# EAGLE design WindRose_V01_0B (EAGLE 6.6.0)
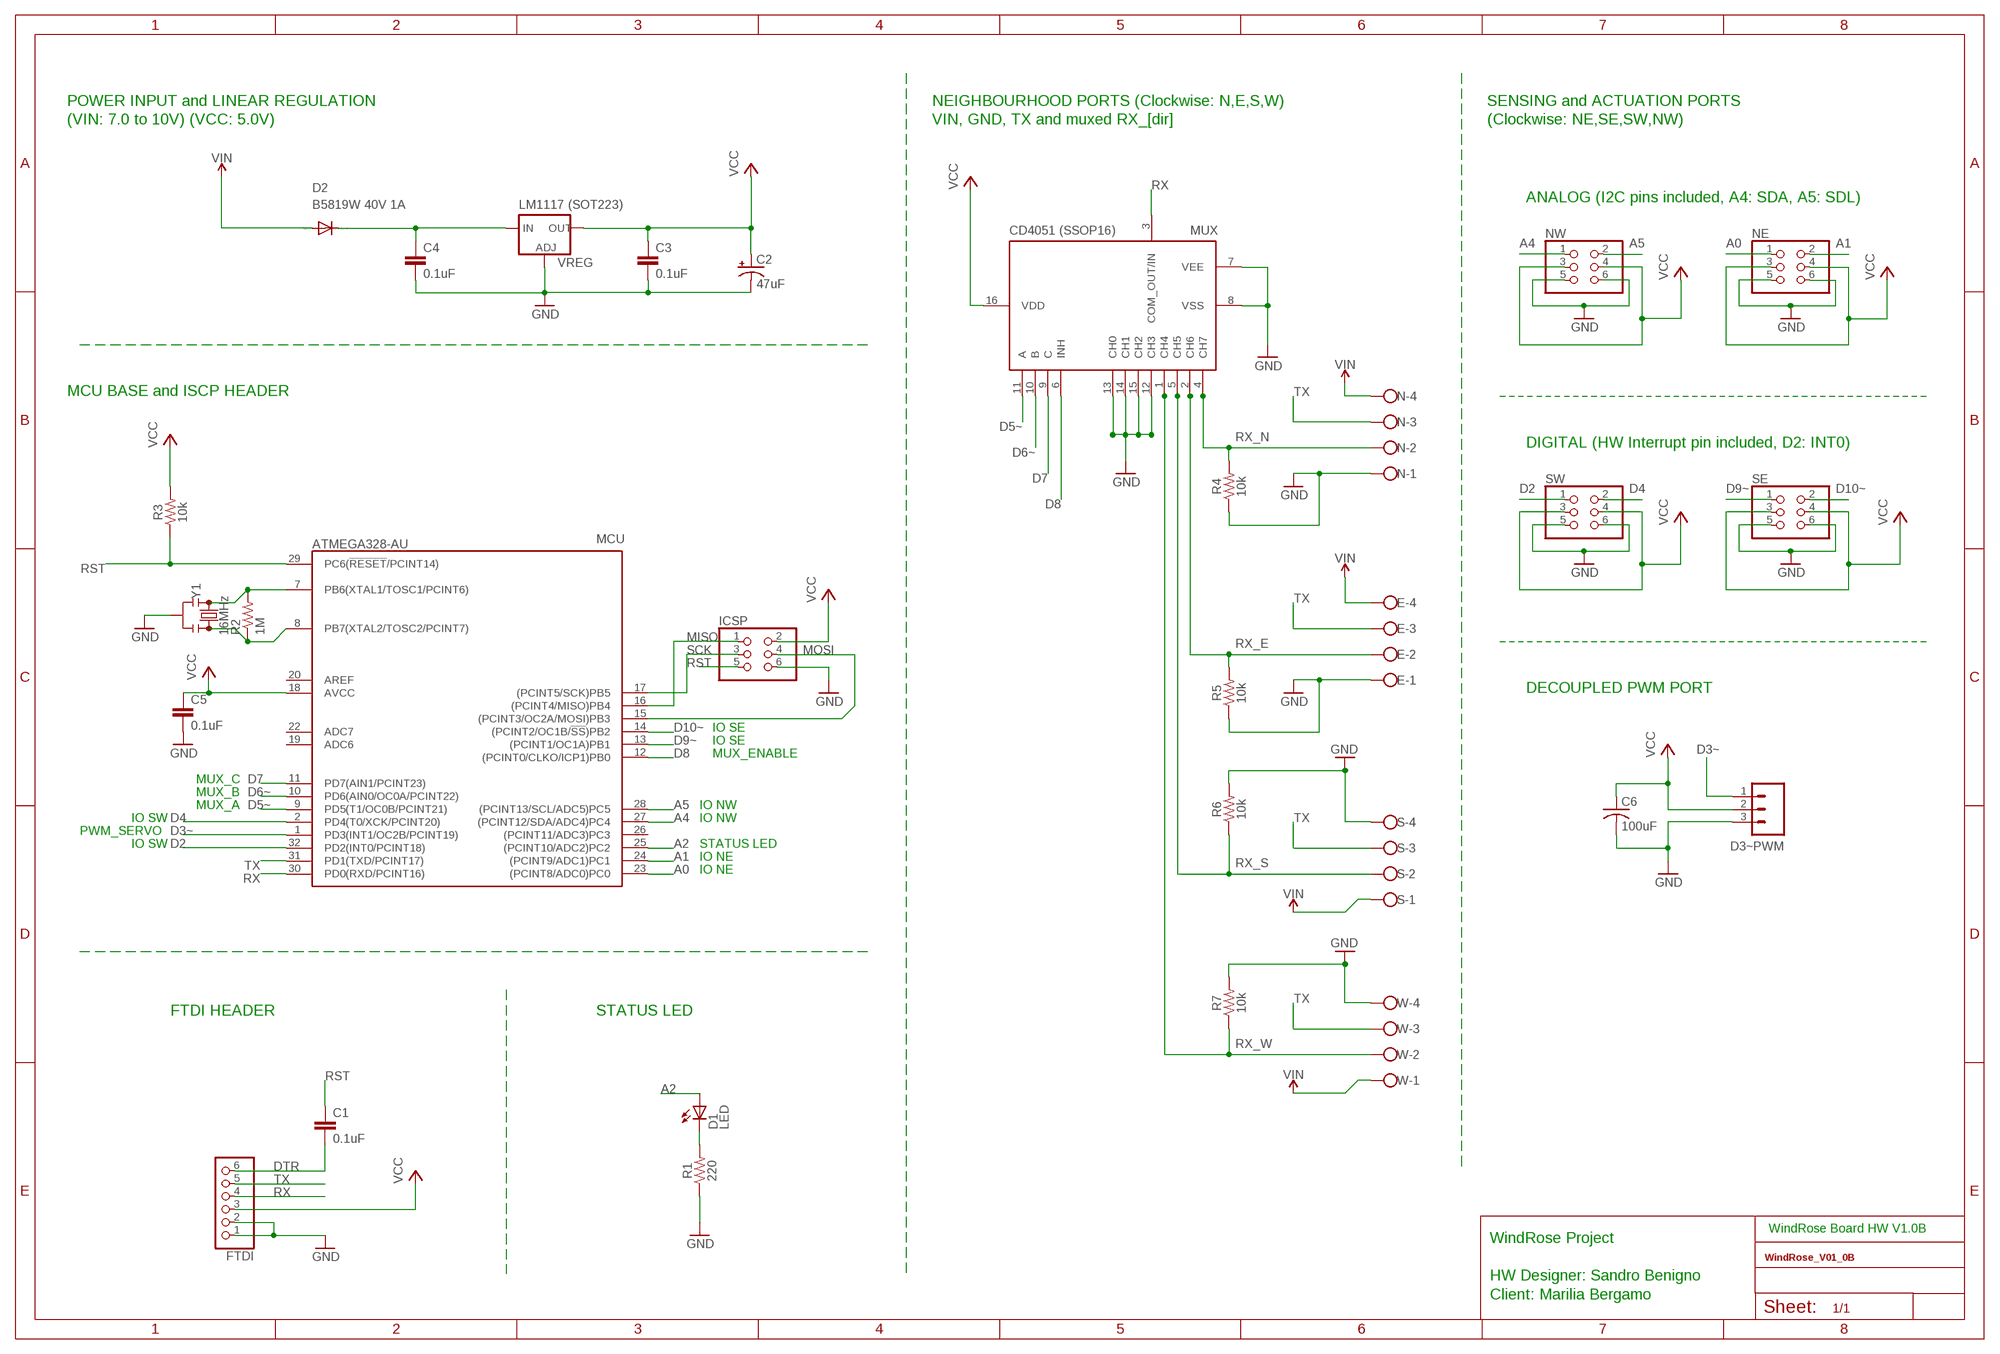
[diagram p0: schematic, sheet 1]

## Parts
C1  0.1uF  0.1UF-0402-6.3V-10%-X7R  [0402]
C2  47uF  10UF-POLAR-EIA3216-16V-10%(TANT)  [EIA3216]
C3  0.1uF  0.1UF-0402-6.3V-10%-X7R  [0402]
C4  0.1uF  0.1UF-0402-6.3V-10%-X7R  [0402]
C5  0.1uF  0.1UF-0402-6.3V-10%-X7R  [0402]
C6  100uF  C-USC3216  [C3216]
D1  LED  LEDCHIP-LED0805  [CHIP-LED0805]
D2  B5819W 40V 1A  DIODE-SOD123  [SOD123]
D3~PWM  455-1750-1-ND  CONN_03  [1X03]
E  W237-4  [W237-4]
FTDI  PINHD-1X6B  [1X06-BIG]
ICSP  PINHD-2X3  [2X03]
MCU  ATMEGA328-AU  [QFP32_7X7_0.80]
MUX  CD4051SSOP16  [SSOP16]
N  W237-4  [W237-4]
NE  PINHD-2X3  [2X03]
NW  PINHD-2X3  [2X03]
R1  220  220OHM-0603-1/10W-1%  [0603]
R2  1M  R-US_R0402  [R0402]
R3  10k  10KOHM-0402-1/16W-1%  [0402]
R4  10k  10KOHM-0402-1/16W-1%  [0402]
R5  10k  10KOHM-0402-1/16W-1%  [0402]
R6  10k  10KOHM-0402-1/16W-1%  [0402]
R7  10k  10KOHM-0402-1/16W-1%  [0402]
S  W237-4  [W237-4]
SE  PINHD-2X3  [2X03]
SW  PINHD-2X3  [2X03]
VREG  V_REG_LM1117SOT223  [SOT223]
W  W237-4  [W237-4]
Y1  16MHz  RESONATOR-16MHZSMD_3.2X1.3  [RESONATOR-SMD-3.2X1.3]

## Nets
A0: MCU.23((PCINT8/ADC0)PC0) NE.1
A1: MCU.24((PCINT9/ADC1)PC1) NE.2
A2: D1.A MCU.25((PCINT10/ADC2)PC2)
A4: MCU.27((PCINT12/SDA/ADC4)PC4) NW.1
A5: MCU.28((PCINT13/SCL/ADC5)PC5) NW.2
D2: MCU.32(PD2(INT0/PCINT18)) SW.1
D3~: D3~PWM.1 MCU.1(PD3(INT1/OC2B/PCINT19))
D4: MCU.2(PD4(T0/XCK/PCINT20)) SW.2
D5~: MCU.9(PD5(T1/OC0B/PCINT21)) MUX.11(A)
D6~: MCU.10(PD6(AIN0/OC0A/PCINT22)) MUX.10(B)
D7: MCU.11(PD7(AIN1/PCINT23)) MUX.9(C)
D8: MCU.12((PCINT0/CLKO/ICP1)PB0) MUX.6(INH)
D9~: MCU.13((PCINT1/OC1A)PB1) SE.1
D10~: MCU.14((PCINT2/OC1B/!SS!)PB2) SE.2
DTR: C1.2 FTDI.6
GND: C2.- C3.2 C4.2 C5.2 C6.2 D3~PWM.3 E.1 FTDI.1 FTDI.2 ICSP.6 MUX.7(VEE) MUX.8(VSS) MUX.12(CH3) MUX.13(CH0) MUX.14(CH1) MUX.15(CH2) N.1 NE.5 NE.6 NW.5 NW.6 R1.1 R4.1 R5.1 R6.2 R7.2 S.4 SE.5 SE.6 SW.5 SW.6 VREG.1(ADJ) W.4 Y1.2
MISO: ICSP.1 MCU.16((PCINT4/MISO)PB4)
MOSI: ICSP.4 MCU.15((PCINT3/OC2A/MOSI)PB3)
N$1: MCU.8(PB7(XTAL2/TOSC2/PCINT7)) R2.1 Y1.3
N$2: MCU.7(PB6(XTAL1/TOSC1/PCINT6)) R2.2 Y1.1
N$3: D1.C R1.2
N$6: C4.1 D2.C VREG.3(IN)
RST: C1.1 ICSP.5 MCU.29(PC6(!RESET!/PCINT14)) R3.1
RX: FTDI.4 MCU.30(PD0(RXD/PCINT16)) MUX.3(COM_OUT/IN)
RX_E: E.2 MUX.2(CH6) R5.2
RX_N: MUX.4(CH7) N.2 R4.2
RX_S: MUX.5(CH5) R6.1 S.2
RX_W: MUX.1(CH4) R7.1 W.2
SCK: ICSP.3 MCU.17((PCINT5/SCK)PB5)
TX: E.3 FTDI.5 MCU.31(PD1(TXD/PCINT17)) N.3 S.3 W.3
VCC: C2.+ C3.1 C5.1 C6.1 D3~PWM.2 FTDI.3 ICSP.2 MCU.18(AVCC) MUX.16(VDD) NE.3 NE.4 NW.3 NW.4 R3.2 SE.3 SE.4 SW.3 SW.4 VREG.2(OUT) VREG.4(OUT)
VIN: D2.A E.4 N.4 S.1 W.1
Unconnected: MCU.19(ADC6) MCU.20(AREF) MCU.22(ADC7) MCU.26((PCINT11/ADC3)PC3)

## Notes on the sheet
- POWER INPUT and LINEAR REGULATION
  (VIN: 7.0 to 10V) (VCC: 5.0V)
- NEIGHBOURHOOD PORTS (Clockwise: N,E,S,W)
  VIN, GND, TX and muxed RX_[dir]
- SENSING and ACTUATION PORTS
  (Clockwise: NE,SE,SW,NW)
- ANALOG (I2C pins included, A4: SDA, A5: SDL)
- LM1117 (SOT223)
- CD4051 (SSOP16) | MUX
- MCU BASE and ISCP HEADER
- DIGITAL (HW Interrupt pin included, D2: INT0)
- DECOUPLED PWM PORT
- IO SE
- IO SE
- MUX_ENABLE
- MUX_C
- MUX_B
- MUX_A | IO NW
- IO SW | IO NW
- PWM_SERVO
- IO SW | STATUS LED
- IO NE
- IO NE
- FTDI HEADER | STATUS LED
- WindRose Board HW V1.0B
- WindRose Project
  
  HW Designer: Sandro Benigno
  Client: Marilia Bergamo

## Power pins joined to a net without a drawn wire
GND: MCU.3(GND) MCU.5(GND) MCU.21(GND)
VCC: MCU.4(VCC) MCU.6(VCC)

## Library data of the parts
C1 C3-C5 = SparkFun-Capacitors:0.1UF: 0.1µF ceramic capacitors A capacitor is a passive two-terminal electrical component used to store electrical energy temporarily in an electric field.; PROD_ID: CAP-14993
C2 = SparkFun-Capacitors:10UF-POLAR: 10.0µF polarized capacitors A capacitor is a passive two-terminal electrical component used to store electrical energy temporarily in an electric field.; PROD_ID: CAP-00811; VALUE: 10uF
C6 = rcl:C-US: CAPACITOR, American symbol
D1 = led:LED: LED OSRAM: - CHIPLED LG R971, LG N971, LY N971, LG Q971, LY Q971, LO R971, LY R971 LH N974, LH R974 LS Q976, LO Q976, LY Q976 LO Q996 - Hyper CHIPLED LW Q18S LB Q993, LB Q99A, LB R99A - SideLED LS A670, LO A670, LY A670, LG A670, LP A670 LB A673, LV A673, LT A673, LW A673 LH A674 LY A675 LS A676, LA A676, LO A676, LY A676, LW A676 LS A679, LY A679, LG A679 - Hyper Micro SIDELED® LS Y876, LA Y876, LO Y876, LY Y876 LT Y87S - SmartLED LW L88C, LW L88S LB L89C, LB L89S, LG L890 LS L89K, LO L89K, LY L89K LS L896, LA L896, LO L896, LY L896 - TOPLED LS T670, LO T670, LY T670, LG T670, LP T670 LSG T670, LSP T670, LSY T670, LOP T670, LYG T670 LG T671, LOG T671, LSG T671 LB T673, LV T673, LT T673, LW T673 LH T674 LS T676, LA T676, LO T676, LY T676, LB T676, LH T676, LSB T676, LW T676 LB T67C, LV T67C, LT T67C, LS T67K, LO T67K, LY T67K, LW E67C LS E67B, LA E67B, LO E67B, LY E67B, LB E67C, LV E67C, LT E67C LW T67C LS T679, LY T679, LG T679 LS T770, LO T770, LY T770, LG T770, LP T770 LB T773, LV T773, LT T773, LW T773 LH T774 LS E675, LA E675, LY E675, LS T675 LS T776, LA T776, LO T776, LY T776, LB T776 LHGB T686 LT T68C, LB T68C - Hyper Mini TOPLED® LB M676 - Mini TOPLED Santana® LG M470 LS M47K, LO M47K, LY M47K Source: http://www.osram.convergy.de LUXEON: - LUMILED® LXK2-PW12-R00, LXK2-PW12-S00, LXK2-PW14-U00, LXK2-PW14-V00 LXK2-PM12-R00, LXK2-PM12-S00, LXK2-PM14-U00 LXK2-PE12-Q00, LXK2-PE12-R00, LXK2-PE12-S00, LXK2-PE14-T00, LXK2-PE14-U00 LXK2-PB12-K00, LXK2-PB12-L00, LXK2-PB12-M00, LXK2-PB14-N00, LXK2-PB14-P00, LXK2-PB14-Q00 LXK2-PR12-L00, LXK2-PR12-M00, LXK2-PR14-Q00, LXK2-PR14-R00 LXK2-PD12-Q00, LXK2-PD12-R00, LXK2-PD12-S00 LXK2-PH12-R00, LXK2-PH12-S00 LXK2-PL12-P00, LXK2-PL12-Q00, LXK2-PL12-R00 Source: www.luxeon.com KINGBRIGHT: KA-3528ASYC Source: www.kingbright.com
D2 = diode:DIODE-: DIODE
D3~PWM = SparkFun-Connectors:CONN_03: Multi connection point. Often used as Generic Header-pin footprint for 0.1 inch spaced/style header connections On any of the 0.1 inch spaced packages, you can populate with these: Break Away Headers - Straight <https://www.sparkfun.com/products/116> (PRT-00116) Break Away Male Headers - Right Angle <https://www.sparkfun.com/products/553> (PRT-00553) Female Headers <https://www.sparkfun.com/products/115> (PRT-00115) Break Away Headers - Machine Pin <https://www.sparkfun.com/products/117> (PRT-00117) Break Away Female Headers - Swiss Machine Pin <https://www.sparkfun.com/products/743> (PRT-00743) Stackable Header - 3 Pin (Female, 0.1") <https://www.sparkfun.com/products/13875> (PRT-13875) For SCREWTERMINALS and SPRING TERMINALS visit here: Screw Terimnals on SparkFun.com <https://www.sparkfun.com/search/results?term=Screw+Terminals> (5mm/3.5mm/2.54mm spacing) This device is also useful as a general connection point to wire up your design to another part of your project. Our various solder wires solder well into these plated through hole pads. Hook-Up Wire - Assortment (Stranded, 22 AWG) <https://www.sparkfun.com/products/11375> (PRT-11375) Hook-Up Wire - Assortment (Solid Core, 22 AWG) <https://www.sparkfun.com/products/11367> (PRT-11367) View the entire wire category on our website here <https://www.sparkfun.com/categories/141> Special notes: Molex polarized connector foot print use with SKU : PRT-08232 with associated crimp pins and housings.; PROD_ID: XXX-00000
E N S W = con-wago-500:W237-4: WAGO SCREW CLAMP; OC_FARNELL: unknown; OC_NEWARK: unknown
FTDI = adafruit:PINHD-1X6: PIN HEADER
ICSP = pinhead:PINHD-2X3: PIN HEADER
MCU = atmel:ATMEGA*8: 8-bit AVR Microcontroller 4/8/16/32 kbytes flash 512/1k/1k/2k bytes SRAM 256/512/512/1k bytes EEPROM USART, 6/8-channel 10 bit ADC Pin compatible with Atmega8(L,A) Note: ADC6 and ADC7 are not available in 28-lead packages
MUX = MyLib_SAN:CD4051SSOP16: CD405xB CMOS Single 8-Channel Analog Multiplexer/Demultiplexer with Logic-Level Conversion
NE NW SE SW = SparkFun-Retired:PINHD-2X3: PIN HEADER
R1 = SparkFun-Resistors:220OHM: 220Ω resistor A resistor is a passive two-terminal electrical component that implements electrical resistance as a circuit element. Resistors act to reduce current flow, and, at the same time, act to lower voltage levels within circuits. - Wikipedia; PROD_ID: RES-07861
R2 = adafruit:R-US_: RESISTOR, American symbol
R3-R7 = SparkFun-Resistors:10KOHM: 10kΩ resistor A resistor is a passive two-terminal electrical component that implements electrical resistance as a circuit element. Resistors act to reduce current flow, and, at the same time, act to lower voltage levels within circuits. - Wikipedia; PROD_ID: RES-14241
VREG = SparkFun-IC-Power:V_REG_LM1117: Voltage Regulator LM1117 Standard adjustable voltage regulator but in SMD form. Spark Fun Electronics SKU : COM-00595; PROD_ID: VREG-08170
Y1 = SparkFun-Clocks:RESONATOR-16MHZ: 16MHz Resonator Digikey Example <http://www.digikey.com/product-detail/en/murata-electronics-north-america/CSTCE16M0V53-R0/490-1198-1-ND/584635> Frequency: 16MHz Frequency Stability: ±0.3% Frequency Tolerance: ±0.5% Capacitance: 15pF SparkFun Products SparkFun OpenLog <https://www.sparkfun.com/products/13712> SparkFun MicroView - OLED Arduino Module <https://www.sparkfun.com/products/12923>; PROD_ID: XTAL-08900

## Board
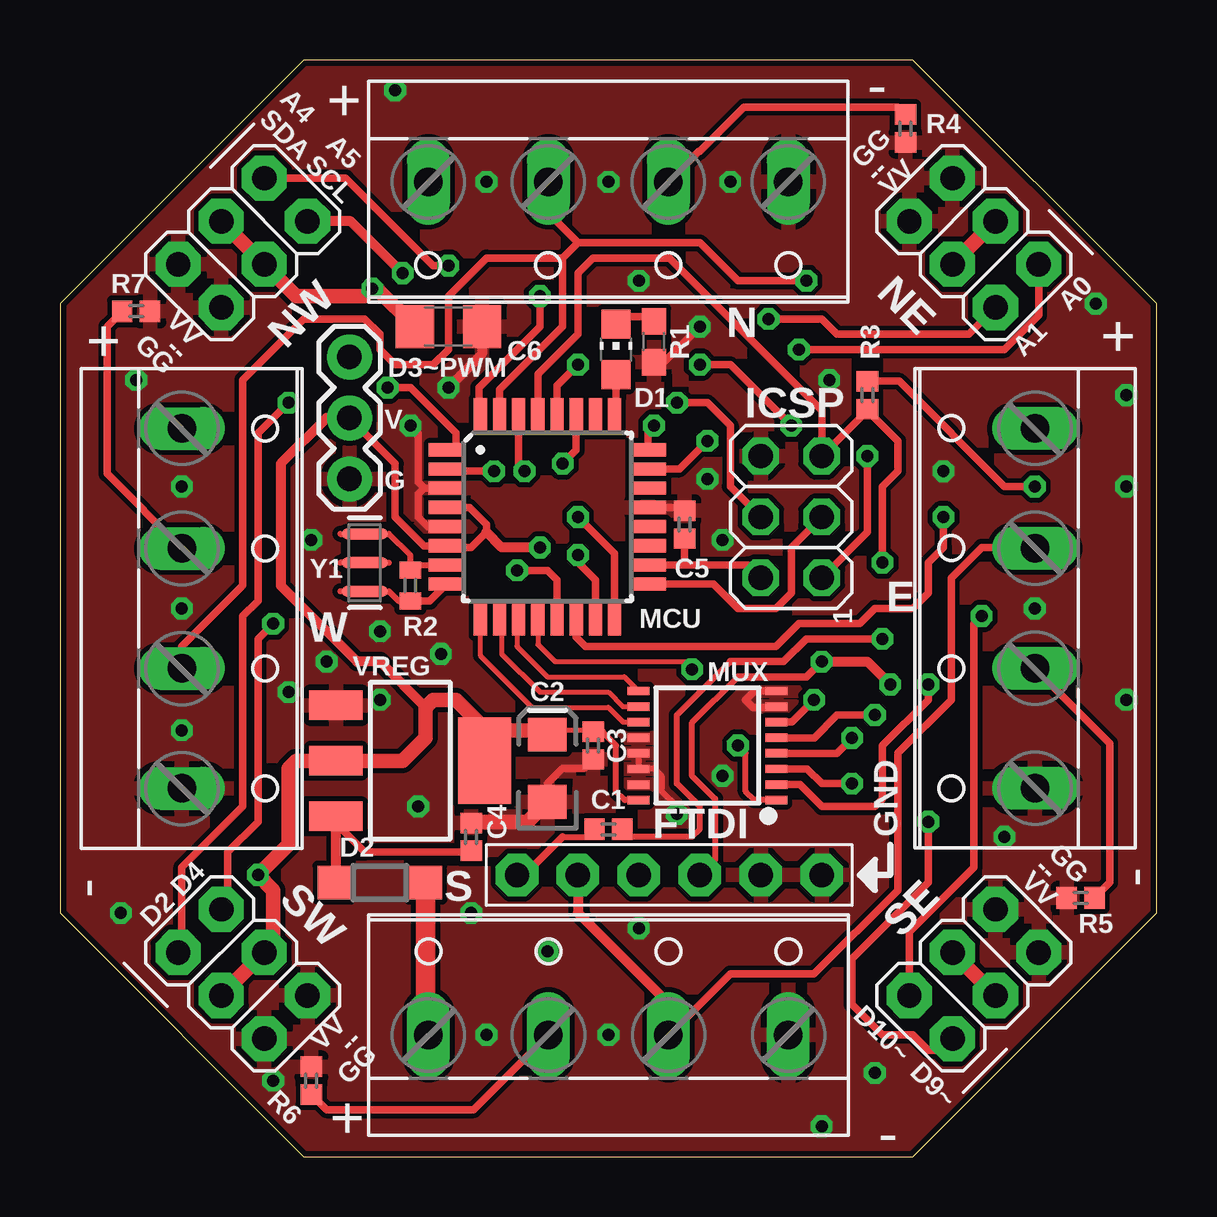
[diagram p1: board, top side]
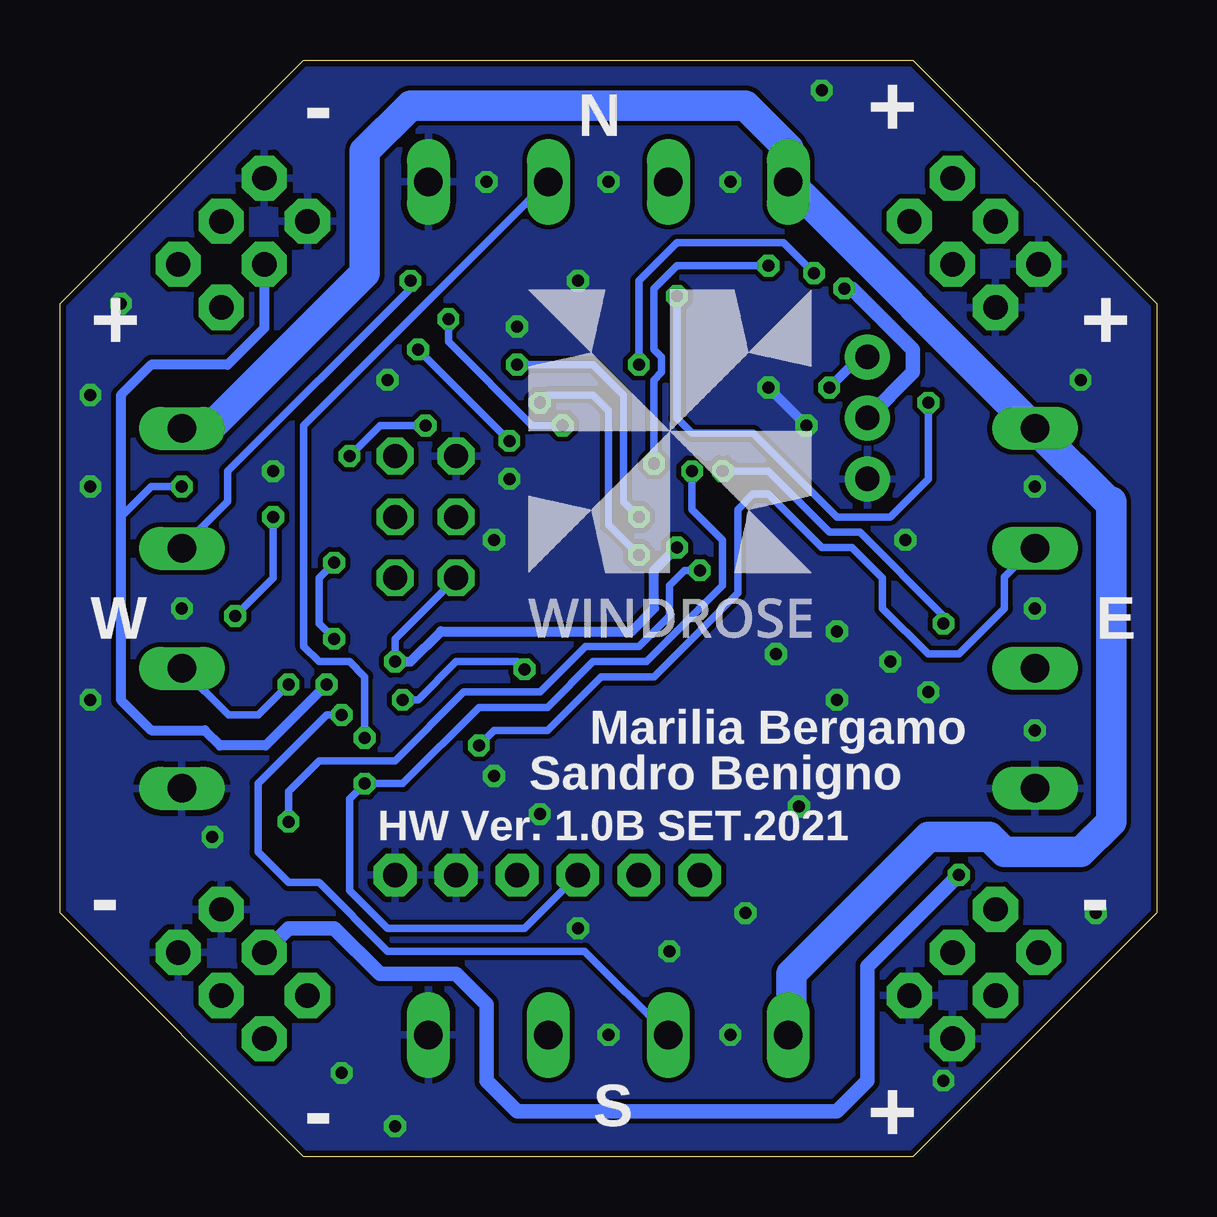
[diagram p2: board, bottom side, seen from below]

Size 45.72 x 45.72 mm. Coordinates in mm from the lower left corner, seen from the top.
Outline: 10.16,0 35.56,0 45.72,10.16 45.72,35.56 35.56,45.72 10.16,45.72 0,35.56 0,10.16 10.16,0
Copper layers (1*16): Top 0.035mm / dielectric 1.5mm / Bottom 0.035mm
Design rules "default *": minimum track width 8mil, minimum drill 19mil, track to track 8mil, track to pad 8mil, pad to pad 8mil, via to via 12mil, smd to smd 8mil, copper to edge 10mil, drill to drill 8mil, minimum pad ring 10mil, minimum via ring 8mil, stop-mask expansion 1mil, vias tented up to drill 24mil, thermal gap 10mil

### Footprints (pad centres in the part's own frame; a part is rotated, then mirrored left to right if it is on the bottom)
0402 = smd 0.85 x 0.9: 1 -0.58,0; 2 0.58,0
EIA3216 = smd 1.4 x 1.6: + 1.4,0; - -1.4,0
C3216 = smd 1.6 x 1.8: 1 -1.4,0; 2 1.4,0
CHIP-LED0805 = smd 1.2 x 1.2: A 0,-1.05; C 0,1.05
SOD123 = smd 1.4 x 1.4: A 1.9,0; C -1.9,0
1X03 = drill 1.016 pad 1.88: 1 0,0; 2 2.54,0; 3 5.08,0
W237-4 = drill 1.194 long: 1 -7.5,-1.27; 2 -2.5,-1.27; 3 2.5,-1.27; 4 7.5,-1.27
1X06-BIG = drill 1.016 pad 1.778 octagon: 1 -6.35,0; 2 -3.81,0; 3 -1.27,0; 4 1.27,0; 5 3.81,0; 6 6.35,0
2X03 = drill 1.016 octagon: 1 -2.54,-1.27; 2 -2.54,1.27; 3 0,-1.27; 4 0,1.27; 5 2.54,-1.27; 6 2.54,1.27
QFP32_7X7_0.80 = smd 1.5 x 0.55: 1 -4.2,2.8; 2 -4.2,2; 3 -4.2,1.2; 4 -4.2,0.4; 5 -4.2,-0.4; 6 -4.2,-1.2; 7 -4.2,-2; 8 -4.2,-2.8; 17 4.2,-2.8; 18 4.2,-2; 19 4.2,-1.2; 20 4.2,-0.4; 21 4.2,0.4; 22 4.2,1.2; 23 4.2,2; 24 4.2,2.8 | smd 0.55 x 1.5: 9 -2.8,-4.2; 10 -2,-4.2; 11 -1.2,-4.2; 12 -0.4,-4.2; 13 0.4,-4.2; 14 1.2,-4.2; 15 2,-4.2; 16 2.8,-4.2; 25 2.8,4.2; 26 2,4.2; 27 1.2,4.2; 28 0.4,4.2; 29 -0.4,4.2; 30 -1.2,4.2; 31 -2,4.2; 32 -2.8,4.2
SSOP16 = smd 0.9 x 0.35: 1 -2.875,2.275; 2 -2.875,1.625; 3 -2.875,0.975; 4 -2.875,0.325; 5 -2.875,-0.325; 6 -2.875,-0.975; 7 -2.875,-1.625; 8 -2.875,-2.275; 9 2.875,-2.275; 10 2.875,-1.625; 11 2.875,-0.975; 12 2.875,-0.325; 13 2.875,0.325; 14 2.875,0.975; 15 2.875,1.625; 16 2.875,2.275
2X03' = drill 1.016 pad 1.88 octagon: 1 -2.54,-1.27; 2 -2.54,1.27; 3 0,-1.27; 4 0,1.27; 5 2.54,-1.27; 6 2.54,1.27
0603 = smd 1.1 x 1: 1 -0.85,0; 2 0.85,0
R0402 = smd 0.7 x 0.9: 1 -0.65,0; 2 0.65,0
SOT223 = smd 1.219 x 2.235: 1 -2.311,-3.099; 2 0,-3.099; 3 2.311,-3.099 | smd 3.6 x 2.2: 4 0,3.099
RESONATOR-SMD-3.2X1.3 = smd 0.45 x 1.905: 1 -1.2,0; 2 0,0; 3 1.2,0

### Placement (x,y rotation side)
C1  22.86,13.65 180 top
C2  20.32,16.19 90 top
C3  22.23,17.14 270 top
C4  17.14,13.34 90 top
C5  26.04,26.35 90 top
C6  16.19,34.61 0 top
D1  23.18,33.66 0 top
D2  13.34,11.43 0 top
D3~PWM  12.06,33.34 270 top
E  39.37,22.86 90 top
FTDI  25.4,11.75 180 top
ICSP  30.48,26.67 90 top
MCU  20.32,26.67 0 top
MUX  26.99,17.14 180 top
N  22.86,39.37 180 top
NE  [2X03']  38.1,38.1 135 top
NW  [2X03']  7.62,38.1 225 top
R1  24.77,33.97 90 top
R2  14.61,23.81 90 top
R3  33.66,31.75 90 top
R4  35.24,42.86 90 top
R5  42.55,10.79 0 top
R6  10.48,3.17 90 top
R7  3.17,35.24 0 top
S  22.86,6.35 0 top
SE  [2X03']  38.1,7.62 45 top
SW  [2X03']  7.62,7.62 315 top
U$1  [WINDROSE_LOGO]  26.67,21.32 0 bottom
VREG  14.61,16.51 270 top
W  6.35,22.86 270 top
Y1  12.7,24.77 270 top

### Tracks (layer width: path | path; a pad name or v marks a point on that pad's centre or on a via)
A0  (via drill 0.5)
  Top 0.305: MCU.23 25.81,28.67 v26.99,29.84 | v30.8,33.66 39.37,33.66 40.79,35.08 NE.1
  Bottom 0.305: v26.99,29.84 v30.8,33.66
A1  (via drill 0.5)
  Top 0.305: MCU.24 24.52,30.23 v24.77,30.48 | v29.53,34.92 31.75,34.92 32.38,34.29 37.88,34.29 NE.2
  Bottom 0.305: v24.77,30.48 26.04,30.48 29.53,33.97 v29.53,34.92
A2
  Top 0.305: D1.A 23.18,30.93 MCU.25
A4  (via drill 0.5)
  Top 0.305: MCU.27 21.52,29.46 v20.95,28.89 | v16.19,37.15 15.56,37.15 11.91,40.79 NW.1
  Bottom 0.305: v20.95,28.89 20.95,32.38 20.64,32.7 20.64,33.34 20.95,33.66 20.95,36.2 20,37.15 v16.19,37.15
A5  (via drill 0.5)
  Top 0.305: MCU.28 20.72,32.15 v21.59,33.02
  Top 0.406: NW.2 12.12,39 v14.29,36.83
  Bottom 0.305: v21.59,33.02 21.59,36.51 20,38.1 15.56,38.1 v14.29,36.83
D2  (via drill 0.5)
  Top 0.305: SW.1 5.08,8.67 5.08,12.06 7.62,14.61 7.62,22.54 8.26,23.18 8.26,30.16 v9.53,31.43 | MCU.32 17.46,30.93 17.46,32.07 20,34.61 v20,35.88
  Bottom 0.305: v20,35.88 20,30.8 19.37,30.16 16.83,30.16 13.34,26.67 11.11,26.67 9.53,28.26 v9.53,31.43
D3~  (via drill 0.5)
  Top 0.305: v13.65,32.07 14.61,32.07 16.51,30.16 16.51,29.47 MCU.1
  Bottom 0.406: v13.65,32.07 12.38,33.34 D3~PWM.1
D4  (via drill 0.5)
  Top 0.305: SW.2 6.99,10.58 6.99,12.7 8.26,13.97 8.26,21.59 v8.89,22.23 | MCU.2 16.02,28.57 v18.1,28.57
  Bottom 0.305: v18.1,28.57 16.19,28.57 13.65,26.04 12.38,26.04 8.89,22.54 v8.89,22.23
D5~
  Top 0.203: MCU.9 17.52,20.9 19.68,18.73 22.86,18.73 23.47,18.12 MUX.11
D6~
  Top 0.203: MCU.10 18.41,22.38 18.41,20.95 20,19.37 22.86,19.37 23.46,18.77 MUX.10
D7
  Top 0.203: MCU.11 19.05,22.4 19.05,21.27 20.32,20 23.53,20 MUX.9
D8  (via drill 0.5)
  Top 0.203: MCU.12 19.92,21.36 20.64,20.64 26.04,20.64 v26.35,20.32
  Top 0.305: MUX.6 30.5,18.12 v31.43,19.05
  Bottom 0.305: v26.35,20.32 26.67,20.64 29.21,20.64 30.8,19.05 v31.43,19.05
D9~  (via drill 0.5)
  Top 0.305: MCU.13 20.72,24.05 20.32,24.45 v19.05,24.45 | v36.2,13.97 36.2,11.43 33.02,8.26 33.02,6.35 34.29,5.08 35.56,5.08 36.2,4.45 36.72,4.45 SE.1
  Bottom 0.305: v19.05,24.45 19.68,24.45 20.32,23.81 20.32,22.54 21.59,21.27 23.81,21.27 25.72,19.37 28.89,19.37 31.75,16.51 34.92,16.51 36.2,15.24 v36.2,13.97
D10~  (via drill 0.5)
  Top 0.305: MCU.14 21.52,21.66 21.91,21.27 29.84,21.27 30.8,22.23 33.34,22.23 33.97,22.86 35.56,22.86 36.2,23.5 36.2,24.77 36.83,25.4 v36.83,26.67 | v38.42,22.54 38.1,22.23 38.1,12.06 35.41,9.37 SE.2
  Bottom 0.305: v36.83,26.67 36.83,24.13 v38.42,22.54
DTR
  Top 0.254: 20.95,13.34 21.96,13.34 C1.2
  Top 0.305: FTDI.6 19.37,11.75 20.95,13.34
GND  (via drill 0.5)
  Top 0.254: MUX.13 24.11,16.21 24.13,16.19 24.77,16.19 25.08,15.88 25.08,15.24 25.72,14.61 v25.72,14.29
  Top 0.305: 26.21,27.07 26.04,27.07 | 26.04,27.07 MCU.21 | MCU.5 15.32,26.27 14.92,26.67 14.92,27.62 15.17,27.87 | 15.17,27.87 MCU.3 | MUX.7 29.82,18.73 28.89,18.73 28.57,19.05 28.95,19.42 MUX.8 | 15.17,27.87 14.92,28.12 14.92,30.16 v14.61,30.48 | v26.67,34.61 25.18,33.12 R1.1 | C2.- 20.32,15.56 20.95,16.19 21.85,16.19 C3.2 | C4.2 17.2,13.97 | C5.2 26.04,27.07
  Top 0.406: C6.2 17.59,33.47 v16.19,32.07
  Top 0.61: C2.- 19.5,13.97 17.2,13.97
  Bottom 0.406: v16.19,32.07 v14.61,30.48
  other vias: 26.99,28.26 32.07,32.38 39.37,13.34 17.78,5.08 31.75,1.27 24.13,9.53 36.83,28.57 8.89,3.17 2.54,10.16 22.86,40.64 13.97,44.45 24.13,36.51 43.18,35.56 44.45,31.75 17.78,40.64 5.08,27.94 5.08,17.78 10.48,25.72 14.92,14.61 9.53,19.37 11.11,20.64 13.34,21.91 15.88,20.95 20.32,8.57 17.14,10.16 22.86,5.08 5.08,22.86 40.64,22.86 27.94,40.64 27.62,15.88 27.62,25.72 13.34,19.05 3.17,32.38 44.45,27.94 44.45,19.05 33.97,3.49
  pour Top: 0,35.56 10.16,45.72 35.56,45.72 45.72,35.56 45.72,10.16 35.56,0 10.16,0 0,10.16
  pour Bottom: 10.16,45.72 35.56,45.72 45.72,35.56 45.72,10.16 35.56,0 10.16,0 0,10.16 0,35.56
MISO  (via drill 0.5)
  Top 0.305: MCU.16 23.12,25.14 v21.59,26.67 | v26.67,33.02 27.94,33.02 v30.48,30.48 | v33.66,29.21 33.66,26.04 ICSP.1
  Bottom 0.305: v21.59,26.67 22.23,27.3 22.23,31.75 23.5,33.02 v26.67,33.02 | v30.48,30.48 32.38,30.48 v33.66,29.21
MOSI  (via drill 0.5)
  Top 0.305: MCU.15 22.32,24.04 21.59,24.77 v21.59,25.08 | ICSP.4 27.94,27.94 27.94,30.48 26.99,31.43 v25.72,31.43
  Bottom 0.305: v21.59,25.08 22.86,26.35 22.86,31.11 23.5,31.75 25.4,31.75 v25.72,31.43
N$1
  Top 0.254: 13.72,23.57 14.12,23.16 R2.1
  Top 0.305: R2.1 15.41,23.16 MCU.8
N$2
  Top 0.254: MCU.7 14.81,24.67 R2.2 14.61,25.08 13.72,25.96
N$3
  Top 0.305: R1.2 24.57,35.02 23.5,35.02 D1.C
N$6
  Top 0.305: C4.1 17.09,12.7 12.7,12.7 11.51,13.89 VREG.3
  Top 0.406: D2.C 11.51,11.43 VREG.3
RST  (via drill 0.5)
  Top 0.254: 27.94,20.64 25.72,18.41 25.72,15.56 26.67,14.61 26.67,13.65 26.35,13.34 23.44,13.34 C1.1
  Top 0.305: 27.94,20.64 30.16,20.64 31.11,21.59 v34.29,21.59 | v34.29,24.77 34.29,27.94 34.92,28.57 34.92,29.84 33.66,31.11 | 33.66,31.11 ICSP.5 31.75,31.11 25.4,37.47 22.23,37.47 21.59,36.83 21.59,34.29 19.92,32.62 MCU.29 | R3.1 33.66,31.11
  Bottom 0.305: v34.29,21.59 34.92,22.23 34.92,24.13 v34.29,24.77
RX  (via drill 0.5)
  Top 0.305: MUX.3 31.14,16.17 31.75,15.56 v33.02,15.56 | MCU.30 19.12,28.82 v19.37,28.57
  Bottom 0.305: v19.37,28.57 19.37,26.99 18.1,25.72 18.1,23.81 21.27,20.64 23.5,20.64 25.4,18.73 28.26,18.73 31.43,15.56 v33.02,15.56 33.66,14.92 33.66,11.11 32.07,9.53 26.35,9.53 FTDI.4
RX_E  (via drill 0.5)
  Top 0.305: v36.2,19.68 36.2,19.05 34.29,17.14 34.29,14.92 33.97,14.61 31.75,14.61 30.84,15.52 MUX.2 | E.2 43.76,17.24 43.76,11.43 R5.2
  Bottom 0.305: v36.2,19.68 37.47,18.41 38.7,18.41 E.2
RX_N  (via drill 0.5)
  Top 0.305: N.2 26.63,41.91 26.67,41.91 28.52,43.76 34.92,43.76 R4.2 | MUX.4 32.38,16.82 v33.02,17.46
  Bottom 0.305: v33.02,17.46 33.02,20 33.66,20.64 34.92,20.64 35.56,21.27 35.56,30.48 26.04,40.01 25.72,40.01 25.36,40.36 N.2 25.4,40.6
RX_S  (via drill 0.5)
  Top 0.305: v33.97,18.41 32.38,18.41 31.44,17.47 MUX.5 | S.2 17.24,1.96 11.11,1.96 R6.1
  Bottom 0.305: v33.97,18.41 34.61,18.41 37.47,15.56 37.47,12.7 36.2,11.43 34.92,11.43 32.07,8.57 23.85,8.57 S.2
RX_W  (via drill 0.5)
  Top 0.254: MUX.1 28.95,14.87 28.57,15.24 28.57,16.83 v28.26,17.14
  Top 0.305: W.2 1.96,28.48 1.96,34.61 R7.1
  Bottom 0.305: W.2 5.12,25.4 6.35,24.17 6.35,22.86 8.26,20.95 9.53,20.95 11.43,22.86 11.43,24.13 12.7,25.4 13.97,25.4 16.19,27.62 16.83,27.62 17.46,26.99 17.46,23.5 20.95,20 23.18,20 25.4,17.78 27.62,17.78 v28.26,17.14
SCK
  Top 0.305: MCU.17 27.25,23.87 28.26,22.86 29.84,22.86 30.48,23.5 30.48,25.4 ICSP.3
TX  (via drill 0.5)
  Top 0.305: 21.59,38.1 26.67,38.1 28.26,36.51 v31.11,36.51 | 21.59,38.1 20.32,39.37 20.32,40.64 N.3 | S.3 25.4,5.08 27.94,7.62 31.43,7.62 34.92,11.11 34.92,16.83 37.15,19.05 37.15,24.13 38.42,25.4 40.6,25.4 E.3 | MCU.31 18.32,31.97 20.95,34.61 20.95,37.47 | W.3 5.08,21.27 7.62,23.81 7.62,32.38 10.16,34.92 12.7,34.92 13.34,34.29 13.34,33.66 13.97,33.02 15.56,33.02 16.19,33.66 16.19,35.88 17.78,37.47 20.95,37.47 | 20.95,37.47 21.59,38.1
  Top 0.406: FTDI.5 21.59,10.16 25.36,6.39 S.3
  Bottom 0.305: v31.11,36.51 31.11,36.2 38.73,28.57 38.73,27.3 40.64,25.4 E.3
VCC  (via drill 0.5)
  Top 0.203: C3.1 22.17,17.78 20.32,17.78
  Top 0.254: FTDI.3 27.3,12.38 27.3,14.92 26.35,15.88 26.35,18.1 28.26,20 | MUX.16 23.55,14.87 23.18,15.24 23.18,17.14 22.6,17.73
  Top 0.305: MCU.4 17.06,27.07 17.78,26.35 17.78,26.04 17.14,25.4 16.19,25.4 MCU.6 15.17,25.47 13.97,26.67 13.97,28.89 D3~PWM.2 12.12,30.85 | MCU.18 26.04,24.67 | 26.04,24.67 28.67,24.67 ICSP.2 | v31.75,20.64 31.11,20 28.26,20 | v40.64,27.94 39.37,27.94 34.98,32.33 R3.2 | 19.87,17.59 C2.+ | 22.6,17.73 C3.1 | C5.1 26.04,24.67
  Top 0.406: D3~PWM.2 11.11,30.8 9.21,28.89 9.21,23.81 12.38,20.64 13.34,20.64 15.24,18.73 | v31.75,20.64 33.66,20.64 v34.61,19.68 | v13.02,36.2 13.21,36.2 | v20,25.4 18.41,25.4 17.78,26.04
  Top 0.61: v13.02,36.2 12.7,35.88 9.84,35.88 9.53,36.2 NW.4 NW.3 | NE.3 NE.4 | SW.3 SW.4 8.89,8.89 8.89,11.11 v8.26,11.75 9.53,13.02 9.53,16.19 9.84,16.51 VREG.2 14.29,16.51 15.24,17.46 15.24,18.73 15.56,19.05 16.51,19.05 17.78,17.78 | SE.4 SE.3 | 20.32,17.78 20.13,17.59 C2.+ 20.13,17.78 17.78,17.78 | 13.21,36.2 C6.1 | 17.78,17.78 17.78,16.59 VREG.4
  Bottom 0.305: v40.64,27.94 41.91,27.94 43.18,26.67 | 29.84,23.5 ICSP.2 31.75,21.59 v31.75,20.64
  Bottom 0.406: v31.75,20.64 31.11,20.64 29.84,21.91 21.91,21.91 20.95,22.86 20.95,24.45 v20,25.4 | NE.4 37.2,34.55 38.73,33.02 41.91,33.02 43.18,31.75 43.18,26.67 43.18,19.05 41.91,17.78 39.69,17.78 39.05,17.14 37.15,17.14 v34.61,19.68
  Bottom 0.61: D3~PWM.2 10.16,32.7 10.16,33.66 12.7,36.2 v13.02,36.2 | SE.4 36.2,9.53 34.29,9.53 32.38,7.62 29.21,7.62 27.94,6.35 27.94,3.17 26.67,1.91 13.34,1.91 12.06,3.17 12.06,7.94 v8.26,11.75
VIN
  Top 0.813: 15.24,5.08 14.97,5.35 15.23,5.35 D2.A
  Top 1.27: 15.24,5.08 S.1
  Bottom 0.813: S.1 15.24,5.08 | 40.52,30.48 E.4
  Bottom 1.27: W.1 N.4 15.36,42.03 17.14,43.81 31.11,43.81 33.02,41.91 33.02,36.83 39.37,30.48 40.52,30.48 | 4.33,30.36 W.1 | S.1 15.24,5.2 15.24,7.62 9.53,13.34 6.99,13.34 6.35,12.7 3.17,12.7 1.91,13.97 1.91,27.3 2.02,27.3 W.1

### Text on the board
bPlace: + | N | - | + | + | E | W | Marilia Bergamo | Sandro Benigno | HW Ver. 1.0B SET.2021 | - | - | + | S | -
tNames: - | A4 / SDA | + | A5 / SCL | GG / -- / VV | A0 | + | A1 | + | VV / -- / GG | V | G | 1 | GND | - | - | D4 | GG / -- / VV | D2 | VV / -- / GG | D10~ | + | D9~ | -